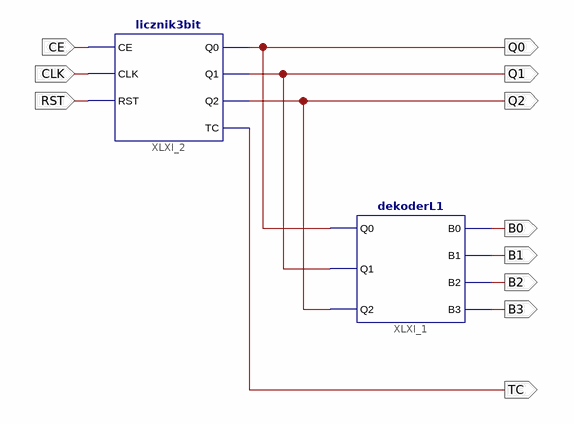
[diagram p0: schematic sheet 1]
// Xilinx ISE schematic licznikL1.sch (spartan3e) as structural Verilog: 2 symbols, 11 ports
module licznikL1 (
  input  CE,
  input  CLK,
  input  RST,
  output Q0,
  output Q1,
  output Q2,
  output B3,
  output B1,
  output B0,
  output B2,
  output TC
);

  dekoderL1 XLXI_1 (.Q0(Q0), .Q1(Q1), .Q2(Q2), .B0(B0), .B2(B2), .B3(B3), .B1(B1));
  licznik3bit XLXI_2 (.RST(RST), .CLK(CLK), .CE(CE), .Q0(Q0), .Q1(Q1), .Q2(Q2), .TC(TC));
endmodule
